# EAGLE design module-buttons (EAGLE 7.4.0)
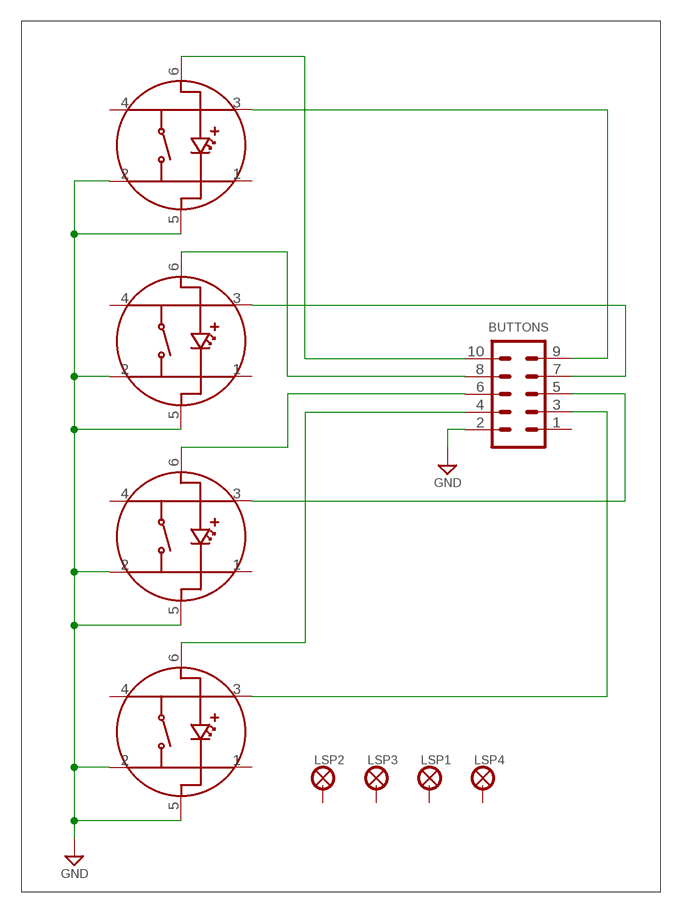
[diagram p0: schematic, sheet 1]

## Parts
BTN1  BUTTON-TL1265  [BUTTON-TL1265]
BTN2  BUTTON-TL1265  [BUTTON-TL1265]
BTN3  BUTTON-TL1265  [BUTTON-TL1265]
BTN4  BUTTON-TL1265  [BUTTON-TL1265]
BUTTONS  MA05-2  [MA05-2]
LSP1  LSP27  [LSP27]
LSP2  LSP27  [LSP27]
LSP3  LSP27  [LSP27]
LSP4  LSP27  [LSP27]

## Nets
GND: BTN1.2 BTN1.5 BTN2.2 BTN2.5 BTN3.2 BTN3.5 BTN4.2 BTN4.5 BUTTONS.2
N$1: BTN3.6 BUTTONS.6
N$2: BTN2.3 BUTTONS.7
N$3: BTN1.3 BUTTONS.9
N$4: BTN3.3 BUTTONS.5
N$5: BTN4.3 BUTTONS.3
N$47: BTN4.6 BUTTONS.4
N$65: BTN2.6 BUTTONS.8
N$69: BTN1.6 BUTTONS.10
Unconnected: BTN1.1 BTN1.4 BTN2.1 BTN2.4 BTN3.1 BTN3.4 BTN4.1 BTN4.4 BUTTONS.1 LSP1.MP LSP2.MP LSP3.MP LSP4.MP

## Library data of the parts
BTN1-BTN4 = MyComponents:BUTTON-TL1265: Illuminated button; MOUSER: 612-TL1265GQSCLR
BUTTONS = MyComponents:MA05-2: Headers & Wire Housing, 2 Row, 10 Position
LSP1-LSP4 = MyComponents:LSP27: Solder Pad, drill 2.75 mm

## Board
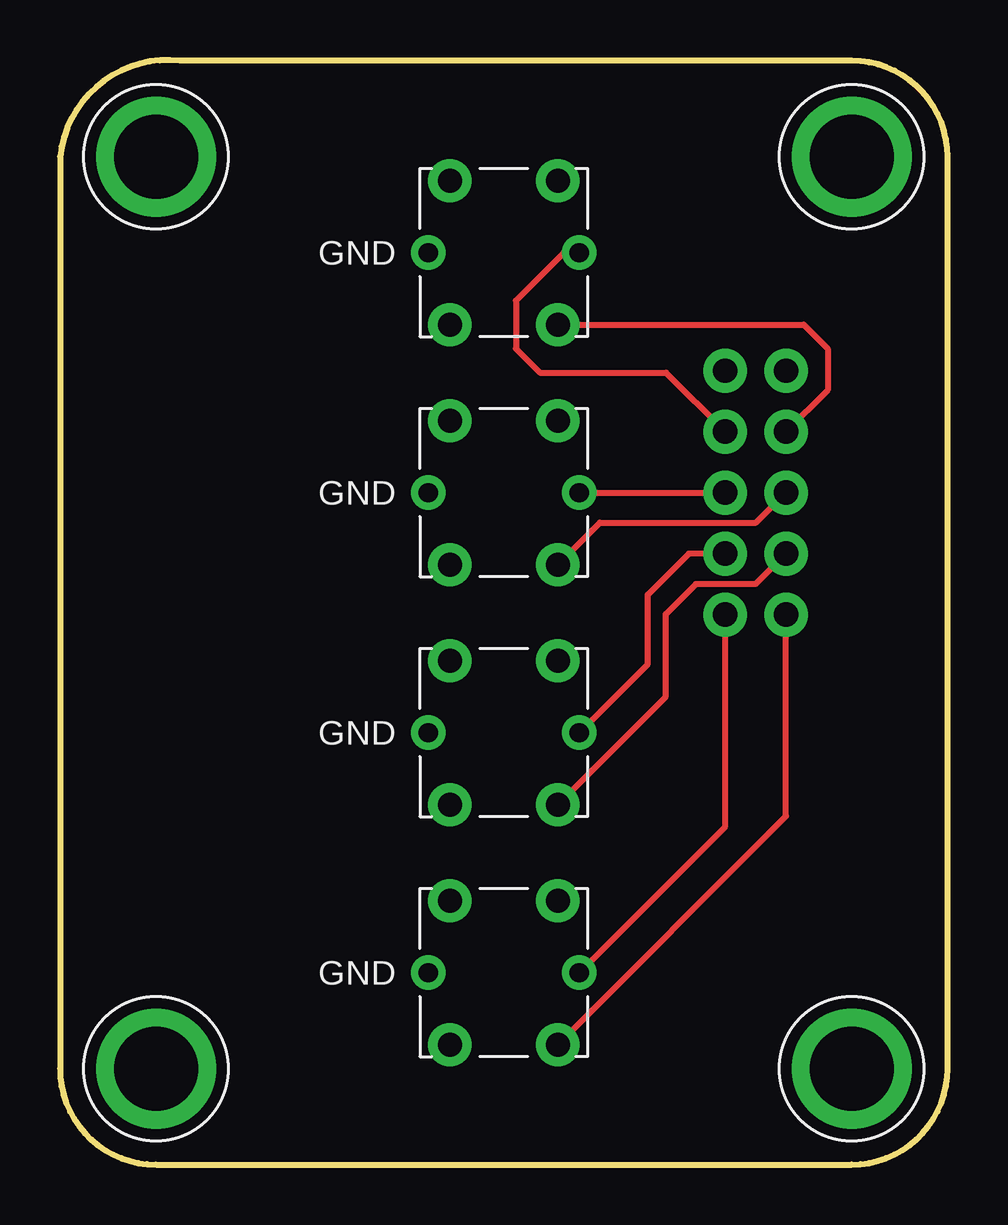
[diagram p1: board, top side]
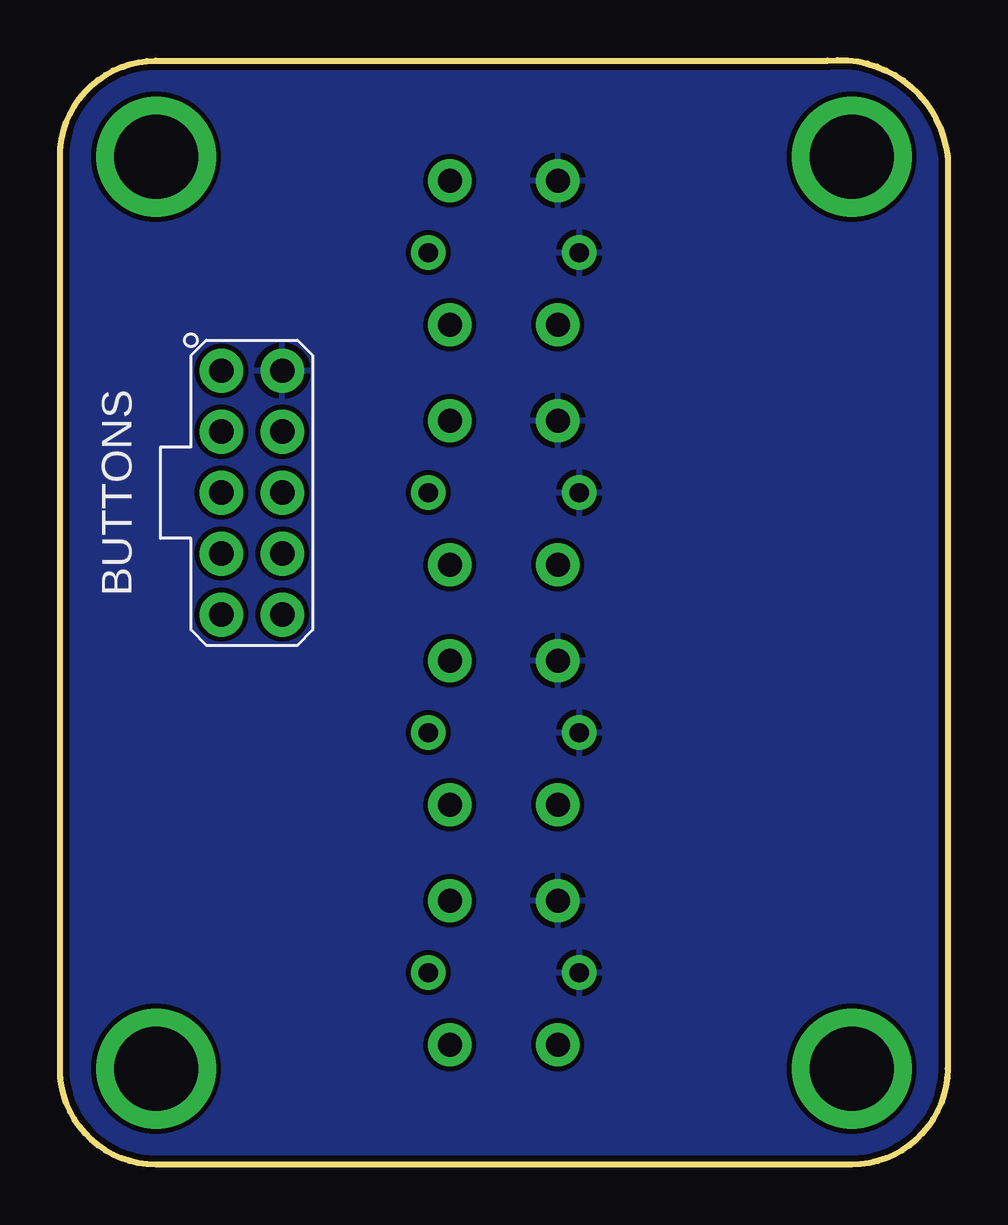
[diagram p2: board, bottom side, seen from below]

Size 37 x 46.03 mm. Coordinates in mm from the lower left corner, seen from the top.
Outline: 0,4 arc90 4,0 33,0 arc90 37,4 37,42 arc90 33,46 5,46 arc90 0,42 0,4
Copper layers (1*16): Top 0.035mm / dielectric 1.5mm / Bottom 0.035mm
Design rules "digital": minimum track width 10mil, minimum drill 19mil, track to track 8mil, track to pad 8mil, pad to pad 7mil, via to via 12mil, smd to smd 7mil, copper to edge 10mil, drill to drill 30mil, minimum pad ring 10mil, minimum via ring 8mil, stop-mask expansion 4mil, vias tented up to drill 0mil, thermal gap 10mil

### Footprints (pad centres in the part's own frame; a part is rotated, then mirrored left to right if it is on the bottom)
BUTTON-TL1265 = drill 1: 1 3,-2.25; 2 -3,-2.25; 3 3,2.25; 4 -3,2.25 | drill 0.8: 5 0,-3.15; 6 0,3.15
MA05-2 = drill 1.016: 1 -5.08,-1.27; 2 -5.08,1.27; 3 -2.54,-1.27; 4 -2.54,1.27; 5 0,-1.27; 6 0,1.27; 7 2.54,-1.27; 8 2.54,1.27; 9 5.08,-1.27; 10 5.08,1.27
LSP27 = drill 3.5 pad 5: MP 0,0

### Placement (x,y rotation side)
BTN1  18.5,8 270 top
BTN2  18.5,18 270 top
BTN3  18.5,28 270 top
BTN4  18.5,38 270 top
BUTTONS  29,28 270 bottom
LSP1  4,42 0 top
LSP2  33,42 0 top
LSP3  33,4 0 top
LSP4  4,4 0 top

### Tracks (layer width: path | path; a pad name or v marks a point on that pad's centre or on a via)
GND
  pour Bottom (rank 4): 0,0 37,0 37,46 0,46
N$1
  Top 0.254: BTN3.6 BUTTONS.6
N$2
  Top 0.254: BTN2.3 25.25,19.5 25.25,22.94 26.5,24.19 29,24.19 BUTTONS.7
N$3
  Top 0.254: BTN1.3 30.27,14.52 BUTTONS.9
N$4
  Top 0.254: BTN3.3 22.5,26.75 29.02,26.75 BUTTONS.5
N$5
  Top 0.254: BTN4.3 31,35 32,34 32,32.27 BUTTONS.3
N$47
  Top 0.254: BTN4.6 21,38 19,36 19,34 20,33 25.27,33 BUTTONS.4
N$65
  Top 0.254: BTN2.6 24.5,20.85 24.5,23.75 26.21,25.46 BUTTONS.8
N$69
  Top 0.254: BTN1.6 27.73,14.08 BUTTONS.10

### Text on the board
tPlace: GND | GND | GND | GND